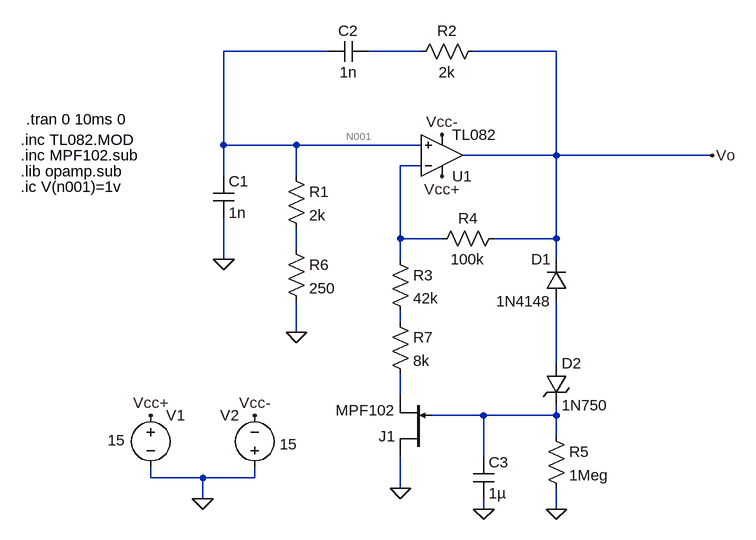
[diagram p0: schematic wien.asc]
wien.asc, the LTspice schematic file:
Version 4
SHEET 1 1104 736
WIRE 240 -64 80 -64
WIRE 384 -64 304 -64
WIRE 592 -64 464 -64
WIRE 80 80 80 -64
WIRE 192 80 80 80
WIRE 384 80 192 80
WIRE 592 96 592 -64
WIRE 592 96 448 96
WIRE 832 96 592 96
WIRE 384 112 352 112
WIRE 80 128 80 80
WIRE 192 128 192 80
WIRE 352 224 352 112
WIRE 416 224 352 224
WIRE 592 224 592 96
WIRE 592 224 496 224
WIRE 192 240 192 208
WIRE 80 256 80 192
WIRE 352 256 352 224
WIRE 592 256 592 224
WIRE 352 352 352 336
WIRE 192 368 192 320
WIRE 592 416 592 320
WIRE 352 464 352 432
WIRE 480 496 400 496
WIRE 592 496 592 480
WIRE 592 496 480 496
WIRE 592 528 592 496
WIRE 480 560 480 496
WIRE -32 592 -32 576
WIRE 48 592 -32 592
WIRE 128 592 128 576
WIRE 128 592 48 592
WIRE 352 608 352 560
WIRE 48 624 48 592
WIRE 480 640 480 624
WIRE 592 640 592 608
FLAG 192 368 0
FLAG 80 256 0
FLAG 592 640 0
FLAG 480 640 0
FLAG 352 608 0
FLAG 416 128 Vcc+
FLAG 416 64 Vcc-
FLAG 48 624 0
FLAG 128 496 Vcc-
FLAG -32 496 Vcc+
FLAG 832 96 Vo
SYMBOL cap 64 128 R0
SYMATTR InstName C1
SYMATTR Value 1n
SYMBOL cap 304 -80 R90
WINDOW 0 0 32 VBottom 2
WINDOW 3 32 32 VTop 2
SYMATTR InstName C2
SYMATTR Value 1n
SYMBOL res 480 -80 R90
WINDOW 0 0 56 VBottom 2
WINDOW 3 32 56 VTop 2
SYMATTR InstName R2
SYMATTR Value 2k
SYMBOL res 336 240 R0
SYMATTR InstName R3
SYMATTR Value 42k
SYMBOL res 512 208 R90
WINDOW 0 0 56 VBottom 2
WINDOW 3 32 56 VTop 2
SYMATTR InstName R4
SYMATTR Value 100k
SYMBOL zener 576 416 R0
SYMATTR InstName D2
SYMATTR Value 1N750
SYMBOL res 576 512 R0
SYMATTR InstName R5
SYMATTR Value 1Meg
SYMBOL cap 464 560 R0
SYMATTR InstName C3
SYMATTR Value 1µ
SYMBOL njf 400 560 R180
SYMATTR InstName J1
SYMATTR Value MPF102
SYMBOL Opamps\\opamp2 416 160 M180
SYMATTR InstName U1
SYMATTR Value TL082
SYMBOL voltage -32 480 R0
WINDOW 123 0 0 Left 0
WINDOW 39 0 0 Left 0
WINDOW 3 -66 54 Left 2
SYMATTR Value 15
SYMATTR InstName V1
SYMBOL voltage 128 592 R180
WINDOW 0 24 96 Left 2
WINDOW 3 -65 52 Left 2
WINDOW 123 0 0 Left 0
WINDOW 39 0 0 Left 0
SYMATTR InstName V2
SYMATTR Value 15
SYMBOL res 176 112 R0
SYMATTR InstName R1
SYMATTR Value 2k
SYMBOL res 176 224 R0
SYMATTR InstName R6
SYMATTR Value 250
SYMBOL res 336 336 R0
SYMATTR InstName R7
SYMATTR Value 8k
SYMBOL diode 608 320 R180
WINDOW 0 24 64 Left 2
WINDOW 3 24 0 Left 2
SYMATTR InstName D1
SYMATTR Value 1N4148
TEXT -224 40 Left 2 !.tran 0 10ms 0
TEXT -232 120 Left 2 !.lib opamp.sub
TEXT -232 72 Left 2 !.inc TL082.MOD
TEXT -232 96 Left 2 !.inc MPF102.sub
TEXT -232 144 Left 2 !.ic V(n001)=1v

The netlist it stands for:
* wien.asc
C1 N001 0 1n
C2 N002 N001 1n
R2 Vo N002 2k
R3 N003 N005 42k
R4 Vo N003 100k
D2 N006 N008 1N750
R5 N008 0 1Meg
C3 N008 0 1µ
J1 0 N008 N007 MPF102
XU1 N001 N003 Vcc+ Vcc- Vo TL082  ; pins In+ In- V+ V- OUT
V1 Vcc+ 0 15
V2 0 Vcc- 15
R1 N001 N004 2k
R6 N004 0 250
R7 N005 N007 8k
D1 N006 Vo 1N4148
.model D D
.lib standard.dio
.model NJF NJF
.model PJF PJF
.lib standard.jft
.tran 0 10ms 0
.lib opamp.sub
.inc TL082.MOD
.inc MPF102.sub
.ic V(n001)=1v
.backanno
.end